# Altium schematic sheet USBC_PD_SOURCING.SchDoc
size A4; SheetNumber: 1; SheetTotal: 42
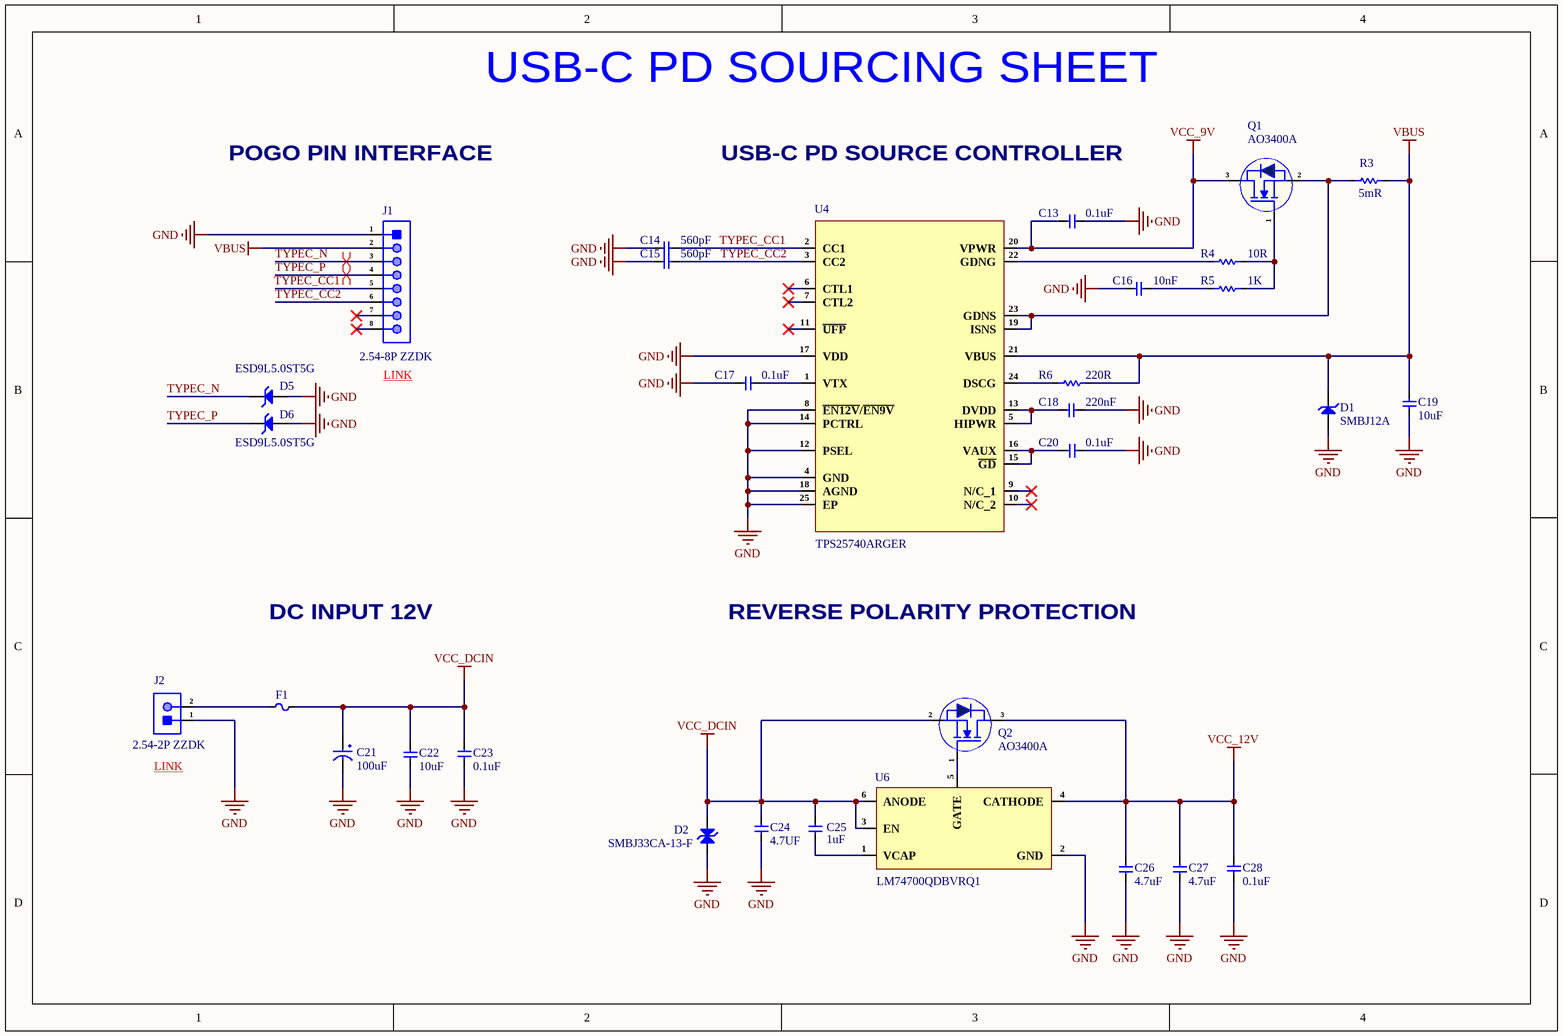
[diagram p0: USBC_PD_SOURCING.SchDoc]

## Parts
C13  0.1uF  [Cap-0402]
C14  560pF  [Cap-0402]
C15  560pF  [Cap-0402]
C16  10nF  [Cap-0402]
C17  0.1uF  [Cap-0402]
C18  220nF  [Cap-0402]
C19  10uF  [Cap-0805]
C20  0.1uF  [Cap-0402]
C21  100uF  [Case-E]
C22  10uF  [Cap-0805]
C23  0.1uF  [Cap-0402]
C24  4.7UF  [Cap-0603]
C25  1uF  [Cap-0402]
C26  4.7uF  [Cap-0805]
C27  4.7uF  [Cap-0805]
C28  0.1uF  [Cap-0402]
D1  SMBJ12A  [SMB_]
D2  SMBJ33CA-13-F  [SMB Bi Directional]
D5  ESD9L5.0ST5G  [SOD-923.]
D6  ESD9L5.0ST5G  [SOD-923.]
F1  BSMD1812-300-24V  [Fuse-1812_]  (value not drawn)
J1  2.54-8P ZZDK  [2.54-8P ZZDK]
J2  2.54-2P ZZDK  [2.54-2P ZZDK]
Q1  AO3400A  [sot-23]
Q2  AO3400A  [sot-23]
R3  5mR  [RES-2512]
R4  10R  [Res-0603]
R5  1K  [Res-0402]
R6  220R  [Res-0402]
U4  TPS25740ARGER  [QFN50P400X400X100-25N-D]
U6  LM74700QDBVRQ1  [SOT-23-6]

## Nets
GND: C13.1 C14.1 C15.1 C16.1 C17.2 C18.2 C19.1 C20.1 C21.2 C22.1 C23.2 C24.1 C26.1 C27.1 C28.2 D1.1(A) D2.1(A) D5.2(A) D6.2(A) J1.1 J2.1 U4.4(GND) U4.8(~{EN12V}/~{EN9V}) U4.12(PSEL) U4.14(PCTRL) U4.17(VDD) U4.18(AGND) U4.25(EP) U6.2(GND)
VBUS: C19.2 D1.2(K) J1.2 R3.2 R6.2 U4.21(VBUS)
VCC_9V: C13.2 Q1.3(D) U4.20(VPWR)
VCC_12V: C26.2 C27.2 C28.1 Q2.3(D) U6.4(CATHODE)
VCC_DCIN: C21.1 C22.2 C23.1 C24.2 C25.2 D2.2(K) F1.2 Q2.2(S) U6.3(EN) U6.6(ANODE)
TYPEC_CC1: C14.2 J1.5 U4.2(CC1)
TYPEC_CC2: C15.2 J1.6 U4.3(CC2)
TYPEC_N: D5.1(K) J1.3
TYPEC_P: D6.1(K) J1.4
NetC16_2: C16.2 R5.1
NetC17_1: C17.1 U4.1(VTX)
NetC18_1: C18.1 U4.5(HIPWR) U4.13(DVDD)
NetC20_2: C20.2 U4.15(~{GD}) U4.16(VAUX)
NetC25_1: C25.1 U6.1(VCAP)
NetF1_1: F1.1 J2.2
NetQ1_1: Q1.1(G) R4.2 R5.2
NetQ1_2: Q1.2(S) R3.1 U4.19(ISNS) U4.23(GDNS)
NetQ2_1: Q2.1(G) U6.5(GATE)
NetR4_1: R4.1 U4.22(GDNG)
NetR6_1: R6.1 U4.24(DSCG)

Not connected (* = marked no-connect by the designer): J1 7* 8*; U4 6(CTL1)* 7(CTL2)* 9(N/C_1)* 10(N/C_2)* 11(~{UFP})*

## Layout directives
differential pair; differential pair class USB: TYPEC_N, TYPEC_P

## Notes on the sheet
- USB-C PD SOURCING SHEET
- POGO PIN INTERFACE
- USB-C PD SOURCE CONTROLLER
- (near J1) LINK <https://www.amazon.ca/Magnetic-Connector-Location-Pogopin-2Pin/dp/B0F52CLFM8/ref=sr_1_1_sspa?crid=E1COTEC3KMVI&dib=eyJ2IjoiMSJ9.HjsVNet4R2aLgz84pz4olNwOqUo3dimBmXdjDjRHhTSwhfz5YwwqNwFwXP9eYXuLzfPie4-csIcXiVZkLWlQsEqjqiFtUWc-4NTSSyGmk2EoFKO2_vJXRIvyGrjTy8s6&th=1>
- DC INPUT 12V
- REVERSE POLARITY PROTECTION
- (near J2) LINK <https://www.alibaba.com/product-detail/Wintai-Tech-150mm-18AWG-PH2-0_1601568955108.html?spm=a2700.details.you_may_like.3.5404374euyQnnw>

## Library data of the parts
C13 C17 C20 C23 C28 = CL05B104KB54PNC: CAP CER 0.1UF 50V X7R 0402; Manufacturer: Samsung; Supplier 1: Digi-Key; Manufacturer Part Number: CL05B104KB54PNC; Stock 1: 8594; Pricing 1: 1=0.1, 10=0.067, 50=0.0366, 100=0.0299, 500=0.02138, 1000=0.01681, 2500=0.01528, 5000=0.01406 (USD); Supplier Part Number 1: 1276-CL05B104KB54PNCDKR-ND; LCSC Part Number: C307331
C14 C15 = CC0402JRX7R9BB561: CAP CER 560PF 50V X7R 0402; Manufacturer: Yageo; Tolerance: 5%; Item Type: Capacitor; Supplier: Future Electronics; Supplier Part Number: 5465612; Manufacturer Part Number: CC0402JRX7R9BB561; RoHS: Yes; Category: Ceramic Capacitors; Stock: 60000; Pricing: 10000=0.0037, 40000=0.0035, 100000=0.0033, 250000=0.0032, 400000=0.003 (USD); Mounting Technology: Surface Mount; Case/Package: 0402; Case Code (Imperial): 0402; Case Code (Metric): 1005; Min Operating Temperature: -55°C; Max Operating Temperature: 125°C; Packaging: Tape and Reel; Voltage Rating: 50V; Voltage Rating (DC): 50V; Value: 560pF; Dielectric: X7R; Termination: SMD/SMT; Series: CC; Construction: Flat; Length: 1mm; Width: 0.5mm; Height: 0.5mm; Thickness: 0.022inch; Depth: 0.5mm; Radiation Hardening: No; Lead Free: Lead Free; Halogen Free: Halogen Free; RoHS Compliant: Yes; ComponentLink1URL: https://datasheet.ciiva.com/26862/getdatasheetpartid-403463-26862618.pdf?src-supplier=Verical; ComponentLink1Description: https://datasheet.ciiva.com/26862/getdatasheetpartid-403463-26862618.pdf?src-supplier=Verical; ComponentLink2URL: https://datasheet.ciiva.com/11464/upy-gphc-x7r-6-3v-to-50v-8-11464855.pdf?src-supplier=Avnet; ComponentLink2Description: https://datasheet.ciiva.com/11464/upy-gphc-x7r-6-3v-to-50v-8-11464855.pdf?src-supplier=Avnet; ComponentLink3URL: https://datasheet.ciiva.com/13210/upy-gphc-x7r-6-3v-to-50v-8-12304-13210970.pdf?src-supplier=Mouser; ComponentLink3Description: https://datasheet.ciiva.com/13210/upy-gphc-x7r-6-3v-to-50v-8-12304-13210970.pdf?src-supplier=Mouser; LCSC Part Number: C541456
C16 = CC0402KRX7R9BB103: CAP CER 10000PF 50V X7R 0402; Manufacturer: Yageo; Tolerance: 10%; Item Type: Capacitor; Supplier 1: Avnet; Manufacturer Part Number: CC0402KRX7R9BB103; RoHS: Yes; Category: Ceramic Capacitors; Stock 1: 995000; Pricing 1: 10000=0.00178 (USD); Mount: Surface Mount; Case/Package: 0402; Case Code (Imperial): 0402; Case Code (Metric): 1005; Min Operating Temperature: -55°C; Max Operating Temperature: 125°C; Capacitance: 10nF; Dielectric: X7R; Packaging: Tape and Reel; Voltage Rating: 50V; Voltage Rating (DC): 50V; Package Quantity: 1; Termination: SMD/SMT; Resistor Type: Ceramic; Voltage: 50V; Series: CC; Length: 1mm; Width: 0.02inch; Height: 0.5mm; Thickness: 0.022inch; Depth: 0.5mm; Radiation Hardening: No; RoHS Compliant: Yes; Reach SVHC Compliant: Yes; Lead Free: Lead Free; Halogen Free: Halogen Free; ComponentLink1URL: https://datasheet.ciiva.com/11788/0900766b8079c870-11788375.pdf?src-supplier=RSComponents; ComponentLink1Description: https://datasheet.ciiva.com/11788/0900766b8079c870-11788375.pdf?src-supplier=RSComponents; ComponentLink2URL: https://datasheet.ciiva.com/26862/getdatasheetpartid-138248-26862642.pdf?src-supplier=Verical; ComponentLink2Description: https://datasheet.ciiva.com/26862/getdatasheetpartid-138248-26862642.pdf?src-supplier=Verical; ComponentLink3URL: https://datasheet.ciiva.com/7978/1489800-7978093.pdf?src-supplier=Element14; ComponentLink3Description: https://datasheet.ciiva.com/7978/1489800-7978093.pdf?src-supplier=Element14; ComponentLink4URL: https://datasheet.ciiva.com/28450/1489800-28450377.pdf?src-supplier=Element14; ComponentLink4Description: https://datasheet.ciiva.com/28450/1489800-28450377.pdf?src-supplier=Element14; ComponentLink5URL: https://datasheet.ciiva.com/176/mlccorderingcode-176349.pdf?src-supplier=Digi-Key; ComponentLink5Description: https://datasheet.ciiva.com/176/mlccorderingcode-176349.pdf?src-supplier=Digi-Key; ComponentLink6URL: https://datasheet.ciiva.com/176/mlccorderingcode-176348.pdf?src-supplier=Digi-Key; ComponentLink6Description: https://datasheet.ciiva.com/176/mlccorderingcode-176348.pdf?src-supplier=Digi-Key; ComponentLink7URL: https://datasheet.ciiva.com/176/mlccorderingcode-176350.pdf?src-supplier=Digi-Key; ComponentLink7Description: https://datasheet.ciiva.com/176/mlccorderingcode-176350.pdf?src-supplier=Digi-Key; Supplier Part Number 1: CC0402KRX7R9BB103; LCSC Part Number: C60133
C18 = CC0402KRX5R8BB224: CAP CER 0.22UF 25V X5R 0402; Manufacturer: Yageo; Item Type: Capacitors; Tolerance: 10%; Supplier 1: Mouser; Manufacturer Part Number: CC0402KRX5R8BB224; RoHS: Yes; Stock 1: 61266; Pricing 1: 1=0.10000, 10=0.03300, 50=0.03300, 100=0.02700, 1000=0.01500, 10000=0.01300 (USD); Mount: Surface Mount; Case/Package: 0402; Min Operating Temperature: -55°C; Max Operating Temperature: 85°C; Packaging: Tape and Reel; Capacitance: 220nF; Voltage Rating: 25V; Voltage Rating (DC): 25V; Dielectric: X5R; Length: 0.039inch; Width: 0.02inch; Thickness: 0.022inch; Lead Free: Lead Free; Halogen Free: Halogen Free; RoHS Compliant: Yes; ComponentLink1URL: http://www.yageo.com/documents/recent/UPY-GPHC_X5R_4V-to-50V_25.pdf?src-supplier=Digi-Key; ComponentLink1Description: http://www.yageo.com/documents/recent/UPY-GPHC_X5R_4V-to-50V_25.pdf?src-supplier=Digi-Key; ComponentLink2URL: https://www.yageo.com/upload/media/product/productsearch/datasheet/mlcc/UPY-GPHC_X5R_4V-to-50V_26.pdf?src-supplier=Digi-Key; ComponentLink2Description: https://www.yageo.com/upload/media/product/productsearch/datasheet/mlcc/UPY-GPHC_X5R_4V-to-50V_26.pdf?src-supplier=Digi-Key; ComponentLink3URL: http://www.yageo.com/documents/recent/UPY-GPHC_X5R_4V-to-50V_23.pdf?src-supplier=Digi-Key; ComponentLink3Description: http://www.yageo.com/documents/recent/UPY-GPHC_X5R_4V-to-50V_23.pdf?src-supplier=Digi-Key; Supplier Part Number 1: 603-CC402KRX5R8BB224; LCSC Part Number: C326836
C19 C22 = GRM21BR61H106ME43L: CAP CER 10UF 50V X5R 0805; Manufacturer: Murata; Supplier 1: Digi-Key; Manufacturer Part Number: GRM21BR61H106ME43L; RoHS: Yes; Category: Ceramic Capacitors; Stock 1: 26; Pricing 1: 1=0.44000, 10=0.30700, 50=0.21500, 100=0.18420, 500=0.13818, 1000=0.11668 (USD); Supplier Part Number 1: 490-18664-1-ND; LCSC Part Number: C2190942
C21 = TAJE107M025RNJ: CAP TANT 100UF 20% 25V 2917; Manufacturer: Kyocera AVX; ESR (Equivalent Series Resistance): 300mR; Leakage Current: 25uA; Polarity: Polar; Dissipation Factor: 10%; Supplier 1: Mouser; Manufacturer Part Number: TAJE107M025RNJ; RoHS: Yes; Category: Tantalum Capacitors; Stock 1: 109; Pricing 1: 1=2.81000, 10=2.81000, 50=2.81000, 100=2.19000, 1000=1.76000, 10000=1.76000 (USD); Mount: Surface Mount; Case/Package: 2917; Number of Pins: 2; Case Code (Imperial): 2917; Case Code (Metric): 7343; Min Operating Temperature: -55°C; Max Operating Temperature: 125°C; Capacitance: 100uF; Tolerance: 20%; Packaging: Tape and Reel; Voltage Rating: 25V; Voltage Rating (DC): 25V; Features: General Purpose; Package Quantity: 1; Termination: SMD/SMT; Series: TAJ; Construction: Flat; Length: 7.3mm; Width: 4.3mm; Height: 4.3mm; Depth: 4.3mm; Height - Seated (Max): 0.169inch; Radiation Hardening: No; Lead Free: Lead Free; RoHS Compliant: Yes; REACH SVHC: No SVHC; ComponentLink1URL: https://datasheet.ciiva.com/26787/taje107m025rnj-26787048.pdf?src-supplier=IIIC; ComponentLink1Description: https://datasheet.ciiva.com/26787/taje107m025rnj-26787048.pdf?src-supplier=IIIC; ComponentLink2URL: https://datasheet.ciiva.com/265/taj-265541.pdf?src-supplier=Digi-Key; ComponentLink2Description: https://datasheet.ciiva.com/265/taj-265541.pdf?src-supplier=Digi-Key; ComponentLink3URL: https://datasheet.ciiva.com/265/taj-265542.pdf?src-supplier=Digi-Key; ComponentLink3Description: https://datasheet.ciiva.com/265/taj-265542.pdf?src-supplier=Digi-Key; ComponentLink4URL: https://datasheet.ciiva.com/265/taj-265540.pdf?src-supplier=Digi-Key; ComponentLink4Description: https://datasheet.ciiva.com/265/taj-265540.pdf?src-supplier=Digi-Key; ComponentLink5URL: https://datasheet.ciiva.com/28609/1719052-28609254.pdf?src-supplier=Element14; ComponentLink5Description: https://datasheet.ciiva.com/28609/1719052-28609254.pdf?src-supplier=Element14; ComponentLink6URL: https://datasheet.ciiva.com/11230/taj-11230456.pdf?src-supplier=Avnet; ComponentLink6Description: https://datasheet.ciiva.com/11230/taj-11230456.pdf?src-supplier=Avnet; ComponentLink7URL: https://datasheet.ciiva.com/17339/taj-17339677.pdf?src-supplier=Avnet+Europe; ComponentLink7Description: https://datasheet.ciiva.com/17339/taj-17339677.pdf?src-supplier=Avnet+Europe; ComponentLink8URL: https://datasheet.ciiva.com/22667/1719052-22667581.pdf?src-supplier=Element14; ComponentLink8Description: https://datasheet.ciiva.com/22667/1719052-22667581.pdf?src-supplier=Element14; Supplier Part Number 1: 581-TAJE107M025RNJ; LCSC Part Number: C7230
C24 = CL10A475KA8NQNC: CAP CER 4.7UF 25V X5R 0603; Manufacturer: Samsung; Tolerance: 10%; Supplier 1: Digi-Key; Manufacturer Part Number: CL10A475KA8NQNC; Stock 1: 2252340; Pricing 1: 1=0.37, 10=0.255, 100=0.1528, 500=0.11456, 1000=0.09675 (USD); Mount: Surface Mount; Case/Package: 0603; Case Code (Metric): 1608; Case Code (Imperial): 0603; Contact Plating: Tin; Min Operating Temperature: -55°C; Max Operating Temperature: 85°C; Package Quantity: 1; Packaging: Tape and Reel; Capacitance: 4.7uF; Voltage Rating: 25V; Dielectric: X5R; Termination: Wraparound; Length: 1.6mm; Width: 0.031inch; Thickness: 0.035inch; Depth: 0.8mm; Lead Free: Lead Free; ComponentLink1URL: http://www.samsungsem.com/kr/support/product-search/mlcc/CL10A475KA8NQNC.jsp?src-supplier=Digi-Key; ComponentLink1Description: http://www.samsungsem.com/kr/support/product-search/mlcc/CL10A475KA8NQNC.jsp?src-supplier=Digi-Key; Supplier Part Number 1: 1276-1900-1-ND; LCSC Part Number: C69335
C25 = CC0402KRX5R8BB105: CAP CER 1UF 25V X5R 0402; Manufacturer: Yageo; Tolerance: 10%; Supplier 1: Mouser; Manufacturer Part Number: CC0402KRX5R8BB105; RoHS: Yes; Category: Ceramic Capacitors; Stock 1: 91975; Pricing 1: 1=0.30000, 10=0.20400, 50=0.20400, 100=0.11600, 1000=0.07200, 10000=0.05900 (USD); Mount: Surface Mount; Case/Package: 0402; Case Code (Metric): 1005; Case Code (Imperial): 0402; Weight: 2.3E-05oz; Min Operating Temperature: -55°C; Max Operating Temperature: 85°C; Packaging: Tape and Reel; Capacitance: 1uF; Voltage Rating: 25V; Dielectric: X5R; Termination: SMD/SMT; Voltage Rating (DC): 25V; Package Quantity: 10000; Length: 0.039inch; Width: 0.02inch; Thickness: 0.022inch; Lead Free: Lead Free; Halogen Free: Halogen Free; RoHS Compliant: Yes; ComponentLink1URL: http://www.mouser.com/ds/2/447/Yageo_UPY-GP_NP0_16V-to-50V_9-358835.pdf?src-supplier=Mouser; ComponentLink1Description: http://www.mouser.com/ds/2/447/Yageo_UPY-GP_NP0_16V-to-50V_9-358835.pdf?src-supplier=Mouser; ComponentLink2URL: http://www.yageo.com/documents/recent/UPY-GPHC_X5R_4V-to-50V_25.pdf?src-supplier=Digi-Key; ComponentLink2Description: http://www.yageo.com/documents/recent/UPY-GPHC_X5R_4V-to-50V_25.pdf?src-supplier=Digi-Key; ComponentLink3URL: https://4donline.ihs.com/images/VipMasterIC/IC/YAGO/YAGO-S-A0006851646/YAGO-S-A0006851646-1.pdf?hkey=6D3A4C79FDBF58556ACFDE234799DDF0&src-supplier=Newark; ComponentLink3Description: https://4donline.ihs.com/images/VipMasterIC/IC/YAGO/YAGO-S-A0006851646/YAGO-S-A0006851646-1.pdf?hkey=6D3A4C79FDBF58556ACFDE234799DDF0&src-supplier=Newark; Supplier Part Number 1: 603-CC402KRX5R8BB105; LCSC Part Number: C326568
C26 C27 = GRM21BR61H475KE51L: CAP CER 4.7UF 50V X5R 0805; Manufacturer: Murata; Material: Ceramic; Tolerance: 10%; Item Type: Capacitor; Manufacturer Part Number: GRM21BR61H475KE51L; RoHS: Yes; Category: Ceramic Capacitors; Supplier 1: Rs; Stock 1: 37300; Pricing 1: 500=0.09400, 1000=0.08800, 2000=0.08300, 5000=0.07500 (GBP); Mount: Surface Mount; Case/Package: 0805; Case Code (Metric): 2012; Case Code (Imperial): 0805; Min Operating Temperature: -55°C; Max Operating Temperature: 85°C; Capacitance: 4.7uF; Packaging: Tape and Reel; Dielectric: X5R; Voltage Rating: 50V; Voltage Rating (DC): 50V; Series: GRM; Length: 2mm; Width: 0.049inch; Height: 1.25mm; Thickness: 0.055inch; Depth: 1.25mm; Reach SVHC Compliant: Yes; Lead Free: Lead Free; RoHS Compliant: Yes; ComponentLink1URL: http://www.farnell.com/datasheets/2079186.pdf?src-supplier=Farnell; ComponentLink1Description: http://www.farnell.com/datasheets/2079186.pdf?src-supplier=Farnell; ComponentLink2URL: http://components.arrow.com/part/dataview/61084395S454511N2606?src-supplier=Arrow+Electronics; ComponentLink2Description: http://components.arrow.com/part/dataview/61084395S454511N2606?src-supplier=Arrow+Electronics; ComponentLink3URL: http://www.farnell.com/datasheets/2079186.pdf?src-supplier=Element14; ComponentLink3Description: http://www.farnell.com/datasheets/2079186.pdf?src-supplier=Element14; ComponentLink4URL: http://search.murata.co.jp/Ceramy/image/img/A01X/G101/ENG/GRM21BR61H475KE51-01.pdf?src-supplier=Digi-Key; ComponentLink4Description: http://search.murata.co.jp/Ceramy/image/img/A01X/G101/ENG/GRM21BR61H475KE51-01.pdf?src-supplier=Digi-Key; ComponentLink5URL: https://search.murata.co.jp/Ceramy/image/img/A01X/G101/ENG/GRM21BR61H475KE51-01.pdf?src-supplier=Digi-Key; ComponentLink5Description: https://search.murata.co.jp/Ceramy/image/img/A01X/G101/ENG/GRM21BR61H475KE51-01.pdf?src-supplier=Digi-Key; ComponentLink6URL: http://www.farnell.com/datasheets/2079186.pdf?src-supplier=Newark; ComponentLink6Description: http://www.farnell.com/datasheets/2079186.pdf?src-supplier=Newark; Supplier Part Number 1: 1138707P; LCSC Part Number: C162420
D1 = SMBJ12A: TVS DIODE 12VWM 19.9VC DO214AA; Manufacturer: Littelfuse; Item Type: TVS Diodes; Supplier: Digikey; LCSC Part Number: C151251; Manufacturer Part Number: SMBJ12A; RoHS: Yes; Stock: 39718; Pricing: 1=0.32, 10=0.215, 100=0.104 (USD); ComponentLink1URL: https://datasheet.ciiva.com/15143/getdatasheetpartid-185160-15143884.pdf?src-supplier=Verical; ComponentLink1Description: https://datasheet.ciiva.com/15143/getdatasheetpartid-185160-15143884.pdf?src-supplier=Verical; ComponentLink2URL: https://datasheet.ciiva.com/34302/1546611-34302457.pdf?src-supplier=Jameco; ComponentLink2Description: https://datasheet.ciiva.com/34302/1546611-34302457.pdf?src-supplier=Jameco; ComponentLink3URL: https://datasheet.ciiva.com/25624/0900766b810f4eeb-25624681.pdf?src-supplier=Rs; ComponentLink3Description: https://datasheet.ciiva.com/25624/0900766b810f4eeb-25624681.pdf?src-supplier=Rs; ComponentLink4URL: https://datasheet.ciiva.com/16287/littelfuse-tvs-diode-smbj-16287565.pdf?src-supplier=Future+Electronics; ComponentLink4Description: https://datasheet.ciiva.com/16287/littelfuse-tvs-diode-smbj-16287565.pdf?src-supplier=Future+Electronics; ComponentLink5URL: https://datasheet.ciiva.com/331/littelfuse-tvs-diode-smbj-datasheet-pdf-331137.pdf?src-supplier=Digikey; ComponentLink5Description: https://datasheet.ciiva.com/331/littelfuse-tvs-diode-smbj-datasheet-pdf-331137.pdf?src-supplier=Digikey; ComponentLink6URL: https://datasheet.ciiva.com/331/littelfuse-tvs-diode-smbj-datasheet-pdf-331138.pdf?src-supplier=Digikey; ComponentLink6Description: https://datasheet.ciiva.com/331/littelfuse-tvs-diode-smbj-datasheet-pdf-331138.pdf?src-supplier=Digikey; ComponentLink7URL: https://datasheet.ciiva.com/331/littelfuse-tvs-diode-smbj-datasheet-pdf-331139.pdf?src-supplier=Digikey; ComponentLink7Description: https://datasheet.ciiva.com/331/littelfuse-tvs-diode-smbj-datasheet-pdf-331139.pdf?src-supplier=Digikey; ComponentLink8URL: https://datasheet.ciiva.com/8062/littelfuse-tvs-diode-smbj-8062301.pdf?src-supplier=Element14; ComponentLink8Description: https://datasheet.ciiva.com/8062/littelfuse-tvs-diode-smbj-8062301.pdf?src-supplier=Element14
D2 = SMBJ33CA-13-F: TVS DIODE 33VWM 53.3VC SMB; Manufacturer: Diodes; Supplier: Future Electronics; Supplier Part Number: 2822294; Manufacturer Part Number: SMBJ33CA-13-F; RoHS: Yes; Category: TVS Diodes; Stock: 33000; Pricing: 3000=0.0754, 9000=0.0725, 15000=0.0712, 30000=0.0695, 60000=0.0668 (USD); ComponentLink1URL: https://datasheet.ciiva.com/335/ds19002-335120.pdf?src-supplier=Avnet; ComponentLink1Description: https://datasheet.ciiva.com/335/ds19002-335120.pdf?src-supplier=Avnet; ComponentLink2URL: https://datasheet.ciiva.com/15143/getdatasheetpartid-139973-15143680.pdf?src-supplier=Verical; ComponentLink2Description: https://datasheet.ciiva.com/15143/getdatasheetpartid-139973-15143680.pdf?src-supplier=Verical; ComponentLink3URL: https://datasheet.ciiva.com/16353/ds19002-16353960.pdf?src-supplier=Future+Electronics; ComponentLink3Description: https://datasheet.ciiva.com/16353/ds19002-16353960.pdf?src-supplier=Future+Electronics; LCSC Part Number: C135068; Item Type: Diode
D5 = ESD9L5.0ST5G: Manufacturer: ON Semiconductor; Capacitance: 0.9pF; Direction: Unidirectional; Clamping Voltage: 9.8V; Number of Unidirectional Channels: 1; Reverse Standoff Voltage: 5V; Min Breakdown Voltage: 5.4V; Power Line Protection: No; Leakage Current: 1uA; Element Configuration: Single; Peak Pulse Current: 1A; Diode Type: ZENER; Reverse Breakdown Voltage: 5.8V; Peak Pulse Power: 150mW; ESD Protection: Yes; Test Current: 1mA; Supplier 1: Digi-Key; Manufacturer Part Number: ESD9L5.0ST5G; RoHS: Yes; Category: ESD and Circuit Protection ICs; Stock 1: 558996; Pricing 1: 1=0.37000, 10=0.25600, 100=0.12500, 500=0.10426, 1000=0.07244, 2000=0.06278 (USD); Case/Package: SOD-923-2; Number of Pins: 2; Contact Plating: Tin,Matte; Min Operating Temperature: -55°C; Max Operating Temperature: 150°C; Package Quantity: 1; Packaging: Tape and Reel; Working Voltage: 5V; Resistor Type: Zener; Series: Automotive, AEC-Q101; Number of Elements: 1; Operating Supply Voltage: 5V; Max Surge Current: 1A; Breakdown Voltage: 5.4V; Number of Channels: 1; Polarity: Unidirectional; Termination: SMD/SMT; Max Reverse Leakage Current: 1uA; Max Breakdown Voltage: 5.4V; Number of Lines: 1; Power Dissipation: 150mW; Clamping Voltage-Max: 9.8V; Length: 0.8mm; Width: 0.65mm; Height: 0.4mm; Depth: 0.6mm; Radiation Hardening: No; Lead Free: Lead Free; RoHS Compliant: Yes; REACH SVHC: No SVHC; Halogen Free: Halogen Free; ComponentLink1URL: https://datasheet.ciiva.com/15143/getdatasheetpartid-185186-15143896.pdf?src-supplier=Verical; ComponentLink1Description: https://datasheet.ciiva.com/15143/getdatasheetpartid-185186-15143896.pdf?src-supplier=Verical; ComponentLink2URL: https://datasheet.ciiva.com/4510/esd9l-d-4510647.pdf?src-supplier=Mouser; ComponentLink2Description: https://datasheet.ciiva.com/4510/esd9l-d-4510647.pdf?src-supplier=Mouser; ComponentLink3URL: https://datasheet.ciiva.com/3304/esd9l-d-3304011.pdf?src-supplier=Avnet; ComponentLink3Description: https://datasheet.ciiva.com/3304/esd9l-d-3304011.pdf?src-supplier=Avnet; ComponentLink4URL: https://datasheet.ciiva.com/16437/esd9l-d-16437835.pdf?src-supplier=Future+Electronics; ComponentLink4Description: https://datasheet.ciiva.com/16437/esd9l-d-16437835.pdf?src-supplier=Future+Electronics; ComponentLink5URL: https://datasheet.ciiva.com/339/esd9l-d-339853.pdf?src-supplier=Digi-Key; ComponentLink5Description: https://datasheet.ciiva.com/339/esd9l-d-339853.pdf?src-supplier=Digi-Key; ComponentLink6URL: https://datasheet.ciiva.com/339/esd9l-d-339854.pdf?src-supplier=Digi-Key; ComponentLink6Description: https://datasheet.ciiva.com/339/esd9l-d-339854.pdf?src-supplier=Digi-Key; ComponentLink7URL: https://datasheet.ciiva.com/11195/esd9l-d-11195342.pdf?src-supplier=Avnet; ComponentLink7Description: https://datasheet.ciiva.com/11195/esd9l-d-11195342.pdf?src-supplier=Avnet; ComponentLink8URL: https://datasheet.ciiva.com/25958/esd9l-d-25958446.pdf?src-supplier=Avnet+Europe; ComponentLink8Description: https://datasheet.ciiva.com/25958/esd9l-d-25958446.pdf?src-supplier=Avnet+Europe; ComponentLink9URL: https://datasheet.ciiva.com/339/esd9l-d-339855.pdf?src-supplier=Digi-Key; ComponentLink9Description: https://datasheet.ciiva.com/339/esd9l-d-339855.pdf?src-supplier=Digi-Key; Supplier Part Number 1: ESD9L5.0ST5GOSCT-ND; LCSC Part Number: C82326
D6 = ESD9L5.0ST5G: TVS DIODE 5V 9.8V SOD923; Manufacturer: ON Semiconductor; Capacitance: 0.9pF; Direction: Unidirectional; Number of Unidirectional Channels: 1; Min Breakdown Voltage: 5.4V; Power Line Protection: No; Leakage Current: 1uA; Element Configuration: Single; Peak Pulse Current: 1A; Diode Type: ZENER; Reverse Breakdown Voltage: 5.8V; Peak Pulse Power: 150mW; ESD Protection: Yes; Test Current: 1mA; Supplier 1: Digi-Key; Manufacturer Part Number: ESD9L5.0ST5G; RoHS: Yes; Category: ESD and Circuit Protection ICs; Stock 1: 558996; Pricing 1: 1=0.37000, 10=0.25600, 100=0.12500, 500=0.10426, 1000=0.07244, 2000=0.06278 (USD); Case/Package: SOD-923-2; Number of Pins: 2; Contact Plating: Tin,Matte; Min Operating Temperature: -55°C; Max Operating Temperature: 150°C; Package Quantity: 1; Packaging: Tape and Reel; Clamping Voltage: 9.8V; Reverse Standoff Voltage: 5V; Working Voltage: 5V; Resistor Type: Zener; Series: Automotive, AEC-Q101; Number of Elements: 1; Operating Supply Voltage: 5V; Max Surge Current: 1A; Breakdown Voltage: 5.4V; Number of Channels: 1; Polarity: Unidirectional; Termination: SMD/SMT; Max Reverse Leakage Current: 1uA; Max Breakdown Voltage: 5.4V; Number of Lines: 1; Power Dissipation: 150mW; Clamping Voltage-Max: 9.8V; Length: 0.8mm; Width: 0.65mm; Height: 0.4mm; Depth: 0.6mm; Radiation Hardening: No; Lead Free: Lead Free; RoHS Compliant: Yes; REACH SVHC: No SVHC; Halogen Free: Halogen Free; ComponentLink1URL: https://datasheet.ciiva.com/15143/getdatasheetpartid-185186-15143896.pdf?src-supplier=Verical; ComponentLink1Description: https://datasheet.ciiva.com/15143/getdatasheetpartid-185186-15143896.pdf?src-supplier=Verical; ComponentLink2URL: https://datasheet.ciiva.com/4510/esd9l-d-4510647.pdf?src-supplier=Mouser; ComponentLink2Description: https://datasheet.ciiva.com/4510/esd9l-d-4510647.pdf?src-supplier=Mouser; ComponentLink3URL: https://datasheet.ciiva.com/3304/esd9l-d-3304011.pdf?src-supplier=Avnet; ComponentLink3Description: https://datasheet.ciiva.com/3304/esd9l-d-3304011.pdf?src-supplier=Avnet; ComponentLink4URL: https://datasheet.ciiva.com/16437/esd9l-d-16437835.pdf?src-supplier=Future+Electronics; ComponentLink4Description: https://datasheet.ciiva.com/16437/esd9l-d-16437835.pdf?src-supplier=Future+Electronics; ComponentLink5URL: https://datasheet.ciiva.com/339/esd9l-d-339853.pdf?src-supplier=Digi-Key; ComponentLink5Description: https://datasheet.ciiva.com/339/esd9l-d-339853.pdf?src-supplier=Digi-Key; ComponentLink6URL: https://datasheet.ciiva.com/339/esd9l-d-339854.pdf?src-supplier=Digi-Key; ComponentLink6Description: https://datasheet.ciiva.com/339/esd9l-d-339854.pdf?src-supplier=Digi-Key; ComponentLink7URL: https://datasheet.ciiva.com/11195/esd9l-d-11195342.pdf?src-supplier=Avnet; ComponentLink7Description: https://datasheet.ciiva.com/11195/esd9l-d-11195342.pdf?src-supplier=Avnet; ComponentLink8URL: https://datasheet.ciiva.com/25958/esd9l-d-25958446.pdf?src-supplier=Avnet+Europe; ComponentLink8Description: https://datasheet.ciiva.com/25958/esd9l-d-25958446.pdf?src-supplier=Avnet+Europe; ComponentLink9URL: https://datasheet.ciiva.com/339/esd9l-d-339855.pdf?src-supplier=Digi-Key; ComponentLink9Description: https://datasheet.ciiva.com/339/esd9l-d-339855.pdf?src-supplier=Digi-Key; Supplier Part Number 1: ESD9L5.0ST5GOSCT-ND; LCSC Part Number: C82326
F1 = BSMD1812-300-24V: 24V 3A 40A 6A 1812 Resettable Fuses ROHS; Manufacturer: BHFUSE; Item Type: Fuse; Supplier: LCSC; LCSC Part Number: C7500481; Manufacturer Part Number: BSMD1812-300-24V; RoHS: No; ComponentLink1Description: LCSC; ComponentLink1URL: https://www.lcsc.com/product-detail/Resettable-Fuses_BHFUSE-BSMD1812-300-24V_C7500481.html
J1 = 2.54-8P ZZDK: 1x8P 8P XH 1 2.5mm Tin 2 -25℃~+85℃ Brass 3A Direct Insert Plugin,P=2.5mm Wire To Board Connector ROHS; Manufacturer: SHOU HAN; Manufacturer Part Number: 2.54-8P ZZDK; LCSC Part Number: C18185655
J2 = 2.54-2P ZZDK: 1x2P 2P XH 1 2.5mm Tin 2 -25℃~+85℃ Brass 3A Direct Insert Plugin,P=2.5mm Wire To Board Connector ROHS; Manufacturer: SHOU HAN; Manufacturer Part Number: 2.54-2P ZZDK; Package: Plugin,P=2.5mm; LCSC Part Number: C18185649; Item Type: Wire To Board Connector; ComponentLink1Description: LCSC; ComponentLink1URL: https://www.lcsc.com/product-detail/Wire-To-Board-Connector_SHOU-HAN-2-54-2P-ZZDK_C18185649.html
Q1 Q2 = AO3400A: 30V 5.8A 32mΩ@10V,5.8A 1.4W 1.4V@250uA N Channel SOT-23 MOSFETs ROHS; Manufacturer: BORN; Item Type: Mosfet; ComponentLink1Description: LCSC; ComponentLink1URL: https://www.lcsc.com/product-detail/MOSFETs_BORN-AO3400A_C344010.html; Manufacturer Part Number: AO3400A; Footprint: SOT-23; LCSC Part Number: C344010
R3 = PA2512FKF7W0R005E: RES 0.005 OHM 1% 2W 2512; Manufacturer: Yageo; Item Type: Resistor; Supplier: Digikey; LCSC Part Number: C309526; Manufacturer Part Number: PA2512FKF7W0R005E; RoHS: Yes; Stock: 29748; Pricing: 1=0.74, 10=0.519, 25=0.4448, 50=0.3866, 100=0.3029, 250=0.27708, 500=0.22554, 1000=0.17888 (USD); ComponentLink1URL: http://www.mouser.com/ds/2/447/PYu-PA_E_51_RoHS_5-1077983.pdf?src-supplier=Mouser; ComponentLink1Description: http://www.mouser.com/ds/2/447/PYu-PA_E_51_RoHS_5-1077983.pdf?src-supplier=Mouser; ComponentLink2URL: https://datasheet.octopart.com/PA2512FKF7W0R005E-Yageo-datasheet-137700559.pdf?src-supplier=Newark; ComponentLink2Description: https://datasheet.octopart.com/PA2512FKF7W0R005E-Yageo-datasheet-137700559.pdf?src-supplier=Newark; ComponentLink3URL: http://www.yageo.com/documents/recent/PYu-PA_E_51_RoHS_10.pdf?src-supplier=Digikey; ComponentLink3Description: http://www.yageo.com/documents/recent/PYu-PA_E_51_RoHS_10.pdf?src-supplier=Digikey; ComponentLink4URL: http://www.yageo.com/documents/recent/PYu-PA_E_51_RoHS_6.pdf?src-supplier=Digikey; ComponentLink4Description: http://www.yageo.com/documents/recent/PYu-PA_E_51_RoHS_6.pdf?src-supplier=Digikey; ComponentLink5URL: https://datasheet.octopart.com/PA2512FKF7W0R005E-Yageo-datasheet-102263284.pdf?src-supplier=Future+Electronics; ComponentLink5Description: https://datasheet.octopart.com/PA2512FKF7W0R005E-Yageo-datasheet-102263284.pdf?src-supplier=Future+Electronics
R4 = RC0603FR-0710RL: RES SMD 10 OHM 1% 1/10W 0603; Manufacturer: Yageo; Temperature Coefficient: 200ppm/°C; Power Rating: 100mW; Voltage Rating: 50V; Item type: Resistor; Supplier 1: Digi-Key; Manufacturer Part Number: RC0603FR-0710RL; Stock 1: 10836596; Pricing 1: 1=0.1, 10=0.046, 100=0.0187, 1000=0.0084, 2500=0.00729 (USD); Case/Package: 0603; Number of Pins: 2; Case Code (Imperial): 0603; Case Code (Metric): 1608; Contact Plating: Tin,Matte; Min Operating Temperature: -55°C; Max Operating Temperature: 155°C; Resistance: 10R; Tolerance: 1%; Composition: Thick Film; Packaging: Tape and Reel; Voltage Rating (DC): 50V; Termination: SMD/SMT; Military Standard: Not; Length: 1.6mm; Height: 0.45mm; Width: 0.8mm; Depth: 0.8mm; Radiation Hardening: No; Lead Free: Lead Free; REACH SVHC: No SVHC; ComponentLink1URL: http://www.farnell.com/datasheets/1868787.pdf?src-supplier=Element14; ComponentLink1Description: http://www.farnell.com/datasheets/1868787.pdf?src-supplier=Element14; ComponentLink2URL: http://www.yageo.com/documents/recent/PYu-RC0603_51_RoHS_L_4.pdf?src-supplier=Avnet; ComponentLink2Description: http://www.yageo.com/documents/recent/PYu-RC0603_51_RoHS_L_4.pdf?src-supplier=Avnet; ComponentLink3URL: http://documents.rs-components.com/techlib://itc_doclist_GB.htm?stockno=5048984&src-supplier=RSComponents; ComponentLink3Description: http://documents.rs-components.com/techlib://itc_doclist_GB.htm?stockno=5048984&src-supplier=RSComponents; ComponentLink4URL: http://www.yageo.com/documents/recent/PYu-RC0603_51_RoHS_L_4.pdf?src-supplier=Avnet+Europe; ComponentLink4Description: http://www.yageo.com/documents/recent/PYu-RC0603_51_RoHS_L_4.pdf?src-supplier=Avnet+Europe; Supplier Part Number 1: 311-10.0HRDKR-ND; LCSC Part Number: C109318
R5 = CRCW04021K00FKEDHP: RES SMD 1K OHM 1% 1/5W 0402; Manufacturer: Vishay Dale; Resistance: 1kR; Temperature Coefficient: 100ppm/°C; Power Rating: 125mW; Voltage Rating: 50V; Supplier 1: Digi-Key; Manufacturer Part Number: CRCW04021K00FKEDHP; Stock 1: 315989; Pricing 1: 1=0.15, 10=0.132, 100=0.0506, 1000=0.02226, 2500=0.01923, 5000=0.0172 (USD); Mount: Surface Mount; Case/Package: 0402; Number of Pins: 2; Contact Plating: Tin; Weight: 2.3E-05oz; Case Code (Imperial): 0402; Case Code (Metric): 1005; Size Code: 0402; Min Operating Temperature: -55°C; Max Operating Temperature: 155°C; Tolerance: 1%; Resistor Type: Thick Film; Package Quantity: 10; Packaging: Tape and Reel; Number of Terminations: 2; Termination: SMD/SMT; Max Power Dissipation: 125mW; Voltage Rating (DC): 50V; Features: Automotive AEC-Q200; Series: CRCW-HP; Construction: Rectangular; Technology: THICK FILM; Resistance Tolerance: 1%; Length: 1mm; Width: 0.5mm; Height: 0.3mm; Depth: 0.5mm; Radiation Hardening: No; REACH SVHC: Unknown; Military Standard: Not; Lead Free: Lead Free; RoHS Compliant: Yes; ComponentLink1URL: http://www.farnell.com/datasheets/2339608.pdf?src-supplier=Element14; ComponentLink1Description: http://www.farnell.com/datasheets/2339608.pdf?src-supplier=Element14; ComponentLink2URL: http://www.vishay.com/docs/20043/crcwhpe3.pdf?src-supplier=Digi-Key; ComponentLink2Description: http://www.vishay.com/docs/20043/crcwhpe3.pdf?src-supplier=Digi-Key; ComponentLink3URL: http://www.mouser.com/ds/2/427/crcwhpe3-46056.pdf?src-supplier=Mouser; ComponentLink3Description: http://www.mouser.com/ds/2/427/crcwhpe3-46056.pdf?src-supplier=Mouser; ComponentLink4URL: http://www.vishay.com/docs/20043/crcwhpe3.pdf?src-supplier=Avnet; ComponentLink4Description: http://www.vishay.com/docs/20043/crcwhpe3.pdf?src-supplier=Avnet; ComponentLink5URL: http://www.vishay.com/docs/20043/crcwhpe3.pdf?src-supplier=Future+Electronics; ComponentLink5Description: http://www.vishay.com/docs/20043/crcwhpe3.pdf?src-supplier=Future+Electronics; Supplier Part Number 1: 541-1.00KYCT-ND; LCSC Part Number: C313354
R6 = RC0402FR-07220RL: RES 220 OHM 1% 1/16W 0402; Manufacturer: Yageo; Item Type: Resistors; Power Rating: 62.5mW; Voltage Rating: 50V; Temperature Coefficient: 100ppm/°C; Max Power Dissipation: 63mW; Supplier: Digikey; LCSC Part Number: C112291; Manufacturer Part Number: RC0402FR-07220RL; RoHS: Yes; Stock: 225544; Pricing: 1=0.1, 10=0.007, 100=0.0061, 1000=0.0051, 2500=0.00408 (USD); Case/Package: 0402; Pins: 2; Case Code (Imperial): 0402; Case Code (Metric): 1005; Min Operating Temperature: -55°C; Max Operating Temperature: 155°C; Value: 220R; Tolerance: 1%; Packaging: Tape and Reel; Voltage Rating (DC): 50V; Package Quantity: 1; Termination: SMD/SMT; Resistor Type: Thick Film; Number of Terminations: 2; Features: Moisture Resistant; Series: RC; Resistance Tolerance: 1%; Construction: Rectangular; Technology: THICK FILM; Voltage Rating (AC): 50V; Length: 0.039inch; Width: 0.02inch; Height: 0.016inch; Depth: 0.5mm; Reach SVHC Compliant: No; Military Standard: Not; RoHS Compliant: Yes; Lead Free: 5697LeadFree; ComponentLink1URL: https://datasheet.ciiva.com/2453/pyu-r-int-thick-7-2453461.pdf?src-supplier=Digikey; ComponentLink1Description: https://datasheet.ciiva.com/2453/pyu-r-int-thick-7-2453461.pdf?src-supplier=Digikey
U4 = TPS25740ARGER: TPS25740A USB Type-C Rev 1.2 and USB PD 2.0 Source Controller (5V/9V/15V); Manufacturer_Name: Texas Instruments; Manufacturer_Part_Number: TPS25740ARGER; LCSC Part Number: C544309
U6 = LM74700QDBVRQ1: OR Controller N+1 ORing Controller N-Channel 1:1 SOT-23-6; Manufacturer: Texas Instruments; Max Output current: 5A; Turn-On Delay Time: 1.4us; Turn-Off Delay Time: 450ns; Max Supply Voltage: 65V; Min Supply Voltage: 3.2V; Nominal Supply Current: 80uA; Number of Outputs: 1NUMBER; Item Type: IC; Supplier: Mouser; Supplier Part Number: 595-LM74700QDBVRQ1; Manufacturer Part Number: LM74700QDBVRQ1; RoHS: Yes; Category: Power Management ICs; Stock: 11505; Pricing: 1=1.78, 10=1.6, 50=1.6, 100=1.28, 1000=0.877, 10000=0.756 (USD); Mounting Technology: Surface Mount; Case/Package: SOT-23-6; Pins: 6NUMBER; Min Operating Temperature: -40°C; Max Operating Temperature: 125°C; Series: Automotive, AEC-Q100; Length: 2.9mm; Width: 1.6mm; Height: 1.45mm; Thickness: 1.2mm; RoHS Compliant: Yes; ComponentLink1URL: http://www.ti.com/general/docs/suppproductinfo.tsp?distId=10&amp;gotoUrl=http%3A%2F%2Fwww.ti.com%2Flit%2Fgpn%2Flm74700-q1&src-supplier=Digikey; ComponentLink1Description: http://www.ti.com/general/docs/suppproductinfo.tsp?distId=10&amp;gotoUrl=http%3A%2F%2Fwww.ti.com%2Flit%2Fgpn%2Flm74700-q1&src-supplier=Digikey; LCSC Part Number: C2941042